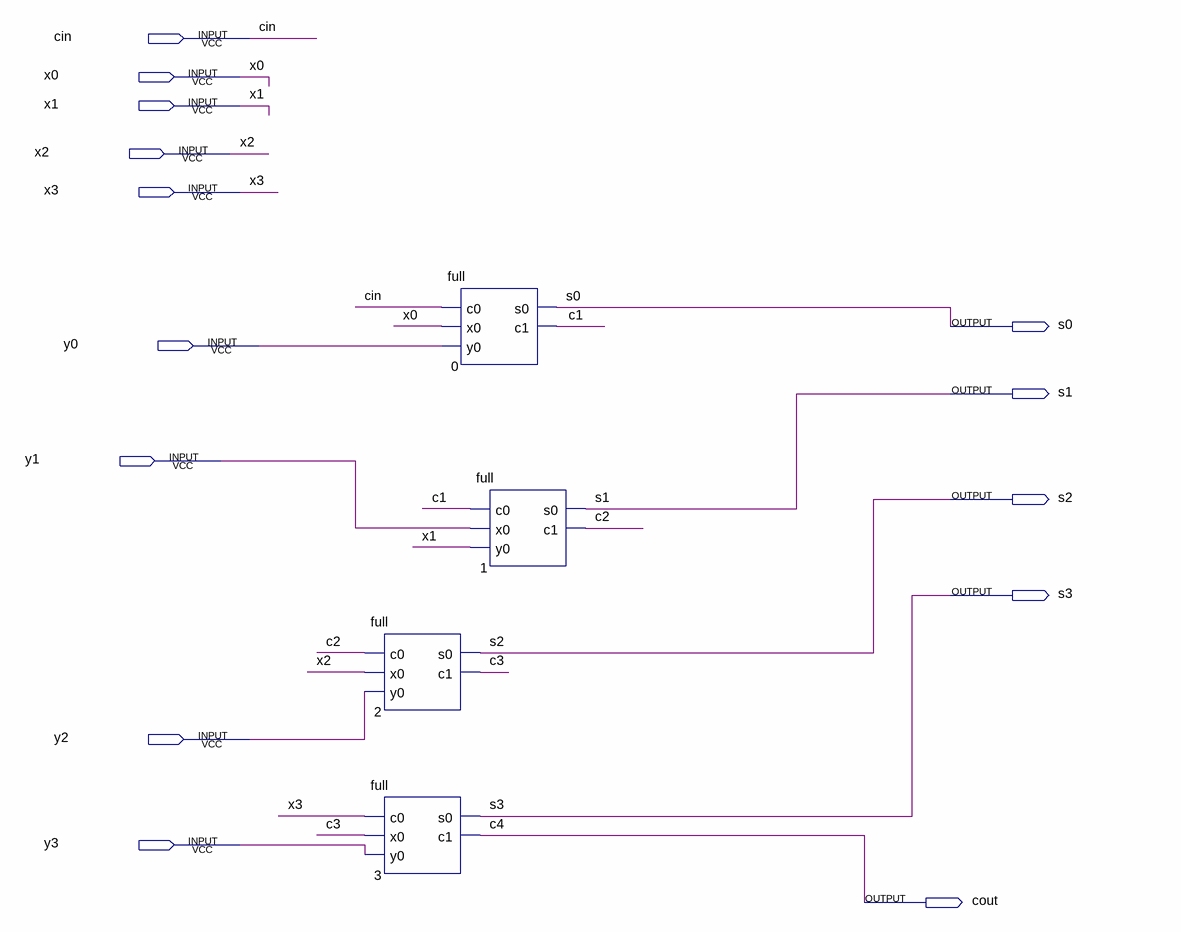
[diagram p0: schematic sheet]
// Quartus schematic somador.bdf as structural Verilog: 4 symbols, 14 pins
module somador (
  input  cin,
  input  x0,
  input  x1,
  input  x2,
  input  x3,
  input  y0,
  input  y1,
  input  y2,
  input  y3,
  output s0,
  output s1,
  output s2,
  output s3,
  output cout
);

  wire c1, c2, c3;

  full u_2 (.c0(c2), .x0(x2), .y0(y2), .s0(s2), .c1(c3));
  full u_3 (.c0(x3), .x0(c3), .y0(y3), .s0(s3), .c1(cout));
  full u_0 (.c0(cin), .x0(x0), .y0(y0), .s0(s0), .c1(c1));
  full u_1 (.c0(c1), .x0(y1), .y0(x1), .s0(s1), .c1(c2));

  // Other names for the same wires on the sheet: c4 = cout
endmodule
